# Altium schematic sheet ActuatorControl_Board_v30.SchDoc: ActuatorControl Board v3.0.
size A4; Author: Milomir Spajić; Organization: Memristor Robotics; Address1: Vladimira Perića Valtera 2; Address2: 21000 Novi Sad; Address3: Serbia; Revision: v2
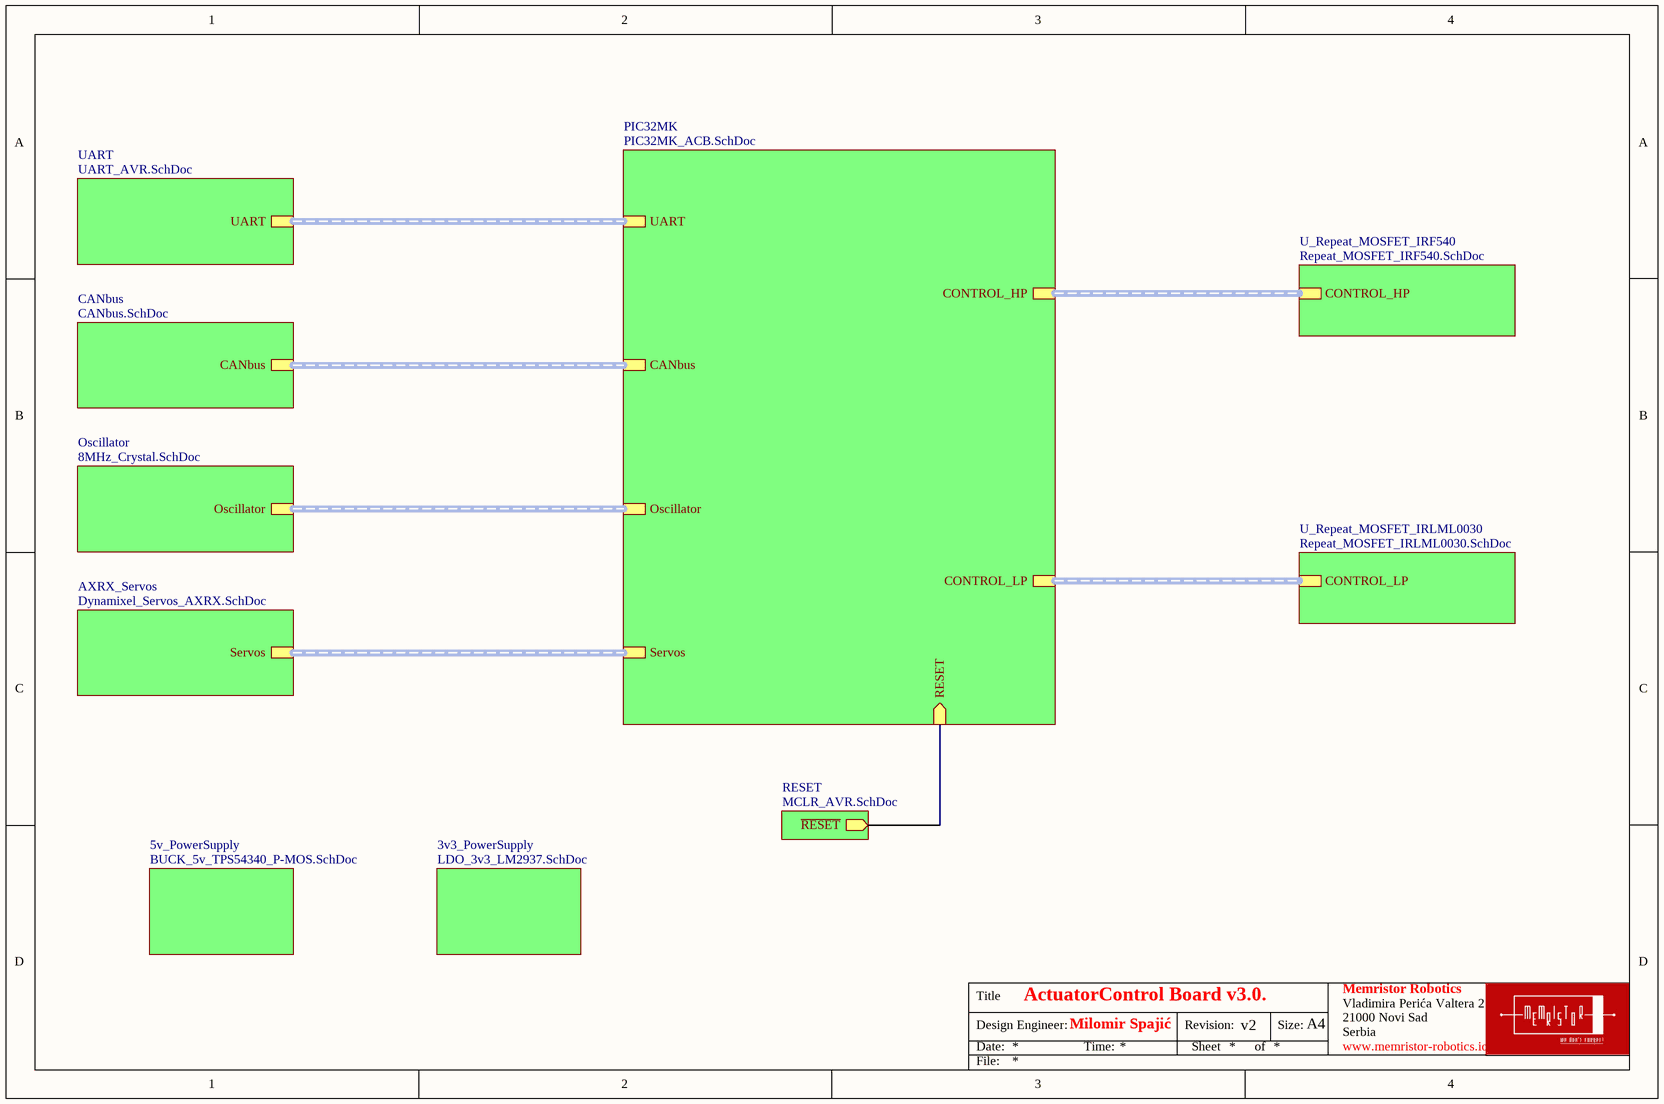
[diagram p0: ActuatorControl_Board_v30.SchDoc]

## Sub-sheets
3v3_PowerSupply = LDO_3v3_LM2937.SchDoc: no entries
5v_PowerSupply = BUCK_5v_TPS54340_P-MOS.SchDoc: no entries
AXRX_Servos = Dynamixel_Servos_AXRX.SchDoc: Servos (harness AXRX_Servos)
CANbus = CANbus.SchDoc: CANbus (harness CANbus)
Oscillator = 8MHz_Crystal.SchDoc: Oscillator (harness Oscillator)
PIC32MK = PIC32MK_ACB.SchDoc: CONTROL_HP (harness CONTROL_HP), CONTROL_LP (harness CONTROL_LP), Oscillator (harness Oscillator), UART (harness UART), Servos (harness AXRX_Servos), CANbus (harness CANbus), RESET (in)
RESET = MCLR_AVR.SchDoc: ~{RESET} (out)
U_Repeat_MOSFET_IRF540 = Repeat_MOSFET_IRF540.SchDoc: CONTROL_HP (harness CONTROL_HP)
U_Repeat_MOSFET_IRLML0030 = Repeat_MOSFET_IRLML0030.SchDoc: CONTROL_LP (harness CONTROL_LP)
UART = UART_AVR.SchDoc: UART (harness UART)

## Nets
(unnamed): sheet RESET/~{RESET}, sheet PIC32MK/RESET

## Buses and harness runs
harness sheet AXRX_Servos/Servos = sheet PIC32MK/Servos
harness sheet CANbus/CANbus = sheet PIC32MK/CANbus
harness sheet Oscillator/Oscillator = sheet PIC32MK/Oscillator
harness sheet PIC32MK/CONTROL_HP = sheet U_Repeat_MOSFET_IRF540/CONTROL_HP
harness sheet PIC32MK/CONTROL_LP = sheet U_Repeat_MOSFET_IRLML0030/CONTROL_LP
harness sheet PIC32MK/UART = sheet UART/UART

## Notes on the sheet
- Title
- Date:
- Design Engineer:
- Time:
- Revision:
- Sheet
- of
- Size:
- A4
- www.memristor-robotics.io
- File: